# EAGLE schematic Node (EAGLE 9.5.2)
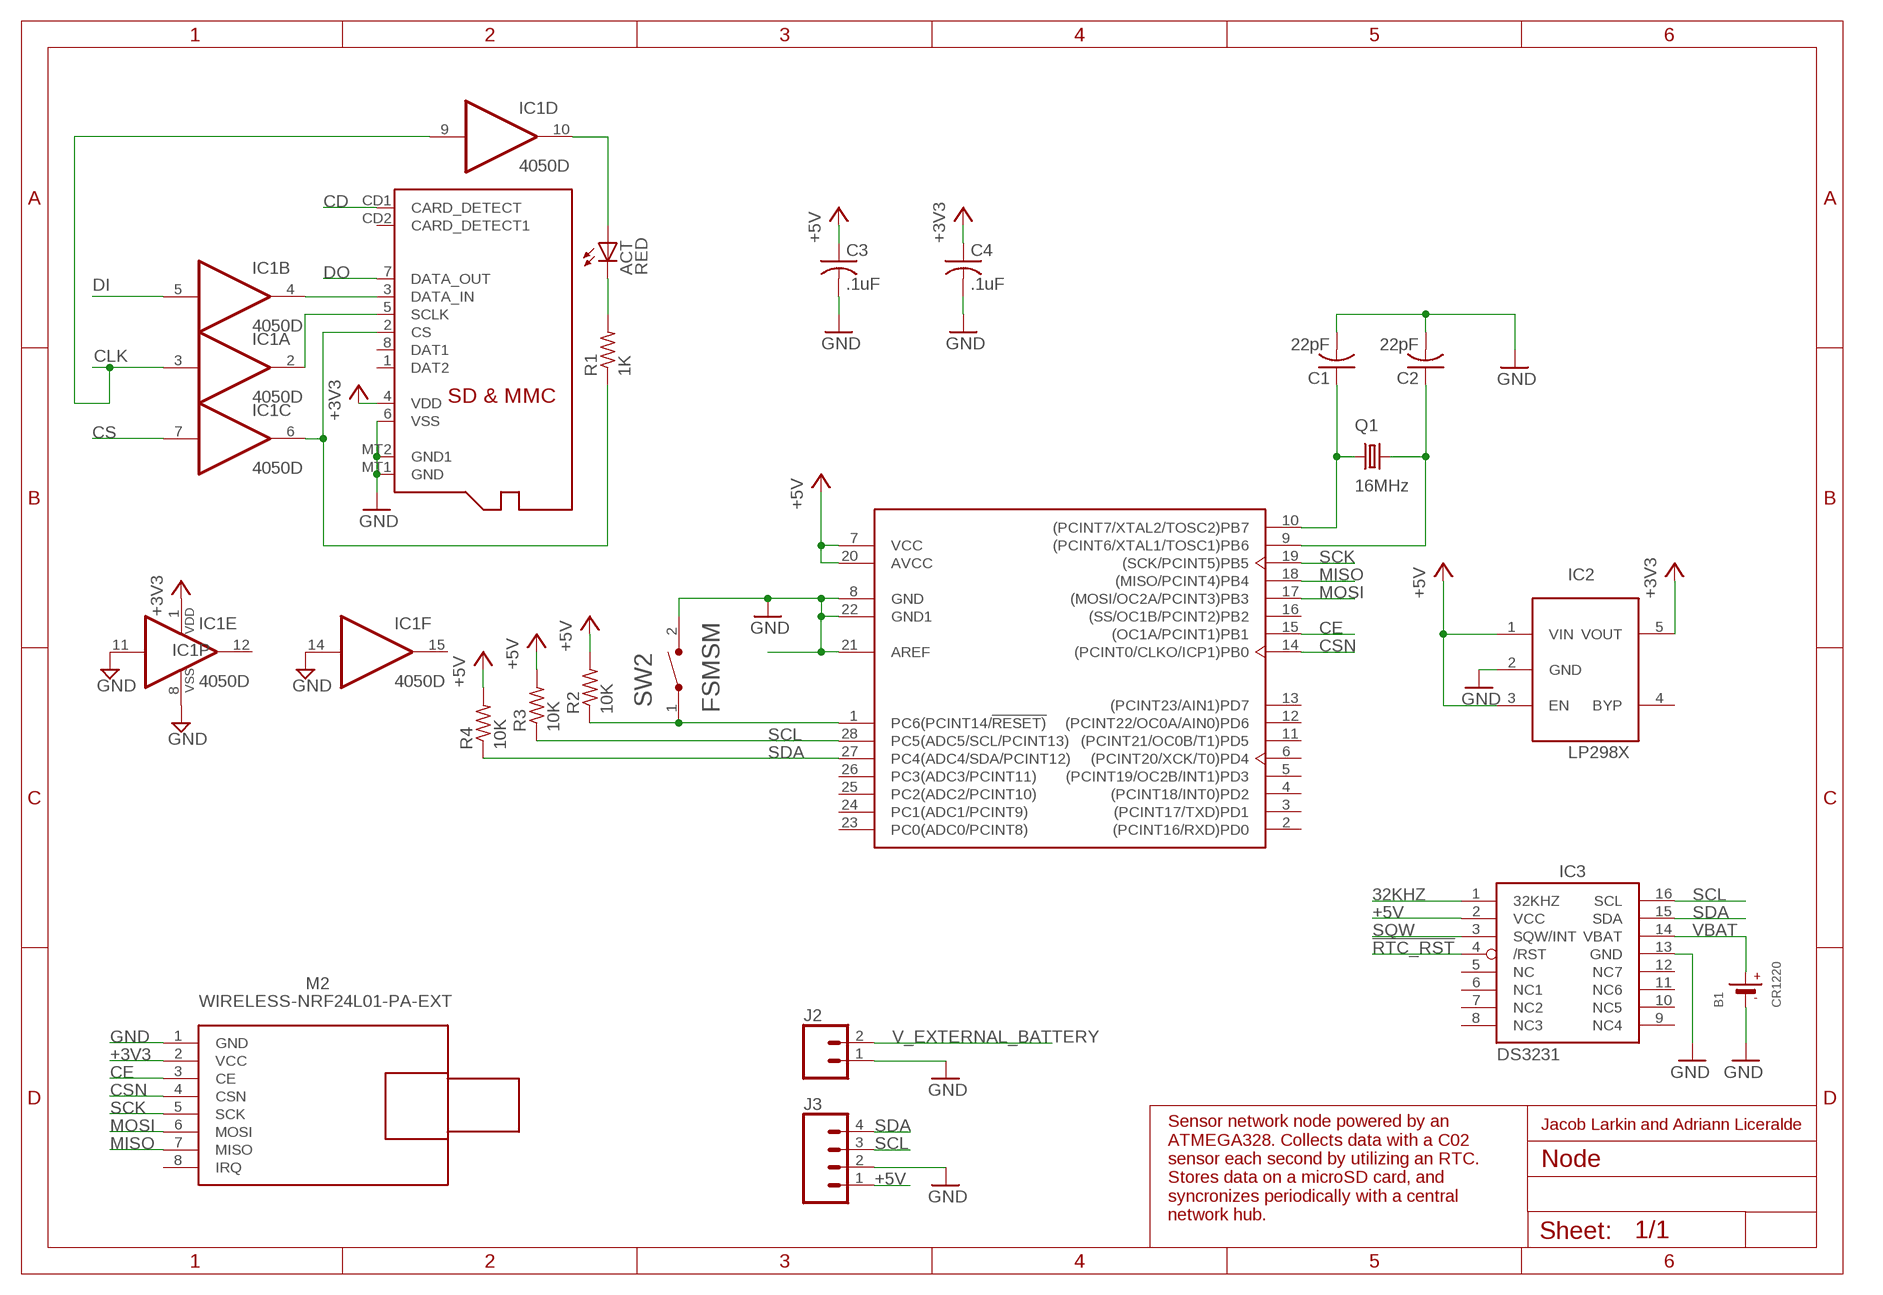
[diagram p0: schematic, sheet 1]

## Parts
ACT  RED  LEDCHIP-LED0805  [CHIP-LED0805]
B1  CR1220  BATTERYCR1220_SMT  [CR1220]
C1  22pF  C-US050-035X075  [C050-035X075]
C2  22pF  C-US050-035X075  [C050-035X075]
C3  .1uF  C-US050-035X075  [C050-035X075]
C4  .1uF  C-US050-035X075  [C050-035X075]
IC1  4050D  [SO16]
IC2  LP298XS  [SOT23-5L]
IC3  DS3231/SO  [SO16W]
J2  CONN_02JST-PTH-2  [JST-2-PTH]
J3  CONN_04JST-PTH  [JST-4-PTH]
M2  WIRELESS-NRF24L01-PA-EXT  [WIRELESS-NRF24L01-PA-EXT]
Q1  16MHz  CRYSTALHC49S  [HC49/S]
R1  1K  R-US_R0805  [R0805]
R2  10K  R-US_R0805  [R0805]
R3  10K  R-US_R0805  [R0805]
R4  10K  R-US_R0805  [R0805]
SW2  FSMSM  [FSMSM]
U2  ATMEGA328P-PU  [DIP-28]
X1  MICROSD  [MICROSD]

## Nets
32KHZ: IC3.1(32KHZ)
!RTC_RST: IC3.4(/RST)
+3V3: C4.1 IC1.1(P:VDD) IC2.5(VOUT) M2.2(VCC) X1.4(VDD)
+5V: C3.1 IC2.1(VIN) IC2.3(EN) IC3.2(VCC) J3.1 R2.2 R3.2 R4.2 U2.7(VCC) U2.20(AVCC)
CD: X1.CD1(CARD_DETECT)
CE: M2.3(CE) U2.15((OC1A/PCINT1)PB1)
CLK: IC1.3(A:I) IC1.9(D:I)
CS: IC1.7(C:I)
CSN: M2.4(CSN) U2.14((PCINT0/CLKO/ICP1)PB0)
DI: IC1.5(B:I)
DO: X1.7(DATA_OUT)
GND: B1.- C1.2 C2.2 C3.2 C4.2 IC2.2(GND) IC3.13(GND) J2.1 J3.2 M2.1(GND) SW2.2 U2.8(GND) U2.21(AREF) U2.22(GND1) X1.6(VSS) X1.MT1(GND) X1.MT2(GND1)
GND_SD: IC1.8(P:VSS) IC1.11(E:I) IC1.14(F:I) ; supply symbol labelled GND
MISO: M2.7(MISO) U2.18((MISO/PCINT4)PB4)
MOSI: M2.6(MOSI) U2.17((MOSI/OC2A/PCINT3)PB3)
N$1: ACT.A IC1.10(D:O)
N$2: IC1.2(A:O) X1.5(SCLK)
N$3: IC1.6(C:O) R1.1 X1.2(CS)
N$4: ACT.C R1.2
N$5: IC1.4(B:O) X1.3(DATA_IN)
N$6: R2.1 SW2.1 U2.1(PC6(PCINT14/!RESET))
N$7: C1.1 Q1.1 U2.10((PCINT7/XTAL2/TOSC2)PB7)
N$8: C2.1 Q1.2 U2.9((PCINT6/XTAL1/TOSC1)PB6)
SCK: M2.5(SCK) U2.19((SCK/PCINT5)PB5)
SCL: IC3.16(SCL) J3.3 R3.1 U2.28(PC5(ADC5/SCL/PCINT13))
SDA: IC3.15(SDA) J3.4 R4.1 U2.27(PC4(ADC4/SDA/PCINT12))
SQW: IC3.3(SQW/INT)
V_EXTERNAL_BATTERY: J2.2
VBAT: B1.+$1(+) IC3.14(VBAT)
Unconnected: IC1.12(E:O) IC1.15(F:O) IC2.4(BYP) IC3.5(NC) IC3.6(NC1) IC3.7(NC2) IC3.8(NC3) IC3.9(NC4) IC3.10(NC5) IC3.11(NC6) IC3.12(NC7) M2.8(IRQ) U2.2((PCINT16/RXD)PD0) U2.3((PCINT17/TXD)PD1) U2.4((PCINT18/INT0)PD2) U2.5((PCINT19/OC2B/INT1)PD3) U2.6((PCINT20/XCK/T0)PD4) U2.11((PCINT21/OC0B/T1)PD5) U2.12((PCINT22/OC0A/AIN0)PD6) U2.13((PCINT23/AIN1)PD7) U2.16((SS/OC1B/PCINT2)PB2) U2.23(PC0(ADC0/PCINT8)) U2.24(PC1(ADC1/PCINT9)) U2.25(PC2(ADC2/PCINT10)) U2.26(PC3(ADC3/PCINT11)) X1.1(DAT2) X1.8(DAT1) X1.CD2(CARD_DETECT1)

## Notes on the sheet
- Jacob Larkin and Adriann Liceralde
- Sensor network node powered by an
  ATMEGA328. Collects data with a C02
  sensor each second by utilizing an RTC.
  Stores data on a microSD card, and
  syncronizes periodically with a central
  network hub.

## Library data of the parts
ACT = adafruit:LED: LED OSRAM: - CHIPLED LG R971, LG N971, LY N971, LG Q971, LY Q971, LO R971, LY R971 LH N974, LH R974 LS Q976, LO Q976, LY Q976 LO Q996 - Hyper CHIPLED LW Q18S LB Q993, LB Q99A, LB R99A - SideLED LS A670, LO A670, LY A670, LG A670, LP A670 LB A673, LV A673, LT A673, LW A673 LH A674 LY A675 LS A676, LA A676, LO A676, LY A676, LW A676 LS A679, LY A679, LG A679 - Hyper Micro SIDELED® LS Y876, LA Y876, LO Y876, LY Y876 LT Y87S - SmartLED LW L88C, LW L88S LB L89C, LB L89S, LG L890 LS L89K, LO L89K, LY L89K LS L896, LA L896, LO L896, LY L896 - TOPLED LS T670, LO T670, LY T670, LG T670, LP T670 LSG T670, LSP T670, LSY T670, LOP T670, LYG T670 LG T671, LOG T671, LSG T671 LB T673, LV T673, LT T673, LW T673 LH T674 LS T676, LA T676, LO T676, LY T676, LB T676, LH T676, LSB T676, LW T676 LB T67C, LV T67C, LT T67C, LS T67K, LO T67K, LY T67K, LW E67C LS E67B, LA E67B, LO E67B, LY E67B, LB E67C, LV E67C, LT E67C LW T67C LS T679, LY T679, LG T679 LS T770, LO T770, LY T770, LG T770, LP T770 LB T773, LV T773, LT T773, LW T773 LH T774 LS E675, LA E675, LY E675, LS T675 LS T776, LA T776, LO T776, LY T776, LB T776 LHGB T686 LT T68C, LB T68C - Hyper Mini TOPLED® LB M676 - Mini TOPLED Santana® LG M470 LS M47K, LO M47K, LY M47K Source: http://www.osram.convergy.de/
B1 = microbuilder:BATTERY: CR1220 SMT - Digikey: 3001K-ND CD2032 BAT-HLD-001 - Digikey: BAT-HLD-001-ND
C1-C4 = rcl:C-US: CAPACITOR, American symbol; SPICEPREFIX: C
IC1 = 40xx:4050: Hex non-inverting BUFFER
IC2 = adafruit:LP298X
IC3 = adafruit:DS3231
J2 = SparkFun-Connectors:CONN_02: Multi connection point. Often used as Generic Header-pin footprint for 0.1 inch spaced/style header connections On any of the 0.1 inch spaced packages, you can populate with these: Break Away Headers - Straight <https://www.sparkfun.com/products/116> (PRT-00116) Break Away Male Headers - Right Angle <https://www.sparkfun.com/products/553> (PRT-00553) Female Headers <https://www.sparkfun.com/products/115> (PRT-00115) Break Away Headers - Machine Pin <https://www.sparkfun.com/products/117> (PRT-00117) Break Away Female Headers - Swiss Machine Pin <https://www.sparkfun.com/products/743> (PRT-00743) For SCREWTERMINALS and SPRING TERMINALS visit here: Screw Terimnals on SparkFun.com <https://www.sparkfun.com/search/results?term=Screw+Terminals> (5mm/3.5mm/2.54mm spacing) This device is also useful as a general connection point to wire up your design to another part of your project. Our various solder wires solder well into these plated through hole pads. Hook-Up Wire - Assortment (Stranded, 22 AWG) <https://www.sparkfun.com/products/11375> (PRT-11375) Hook-Up Wire - Assortment (Solid Core, 22 AWG) <https://www.sparkfun.com/products/11367> (PRT-11367) View the entire wire category on our website here <https://www.sparkfun.com/categories/141> Special notes: Molex polarized connector foot print use with: PRT-08233 with associated crimp pins and housings. 2.54_SCREWTERM for use with PRT-10571. 3.5mm Screw Terminal footprints for PRT-08084 5mm Screw Terminal footprints for use with PRT-08432; PROD_ID: CONN-09863; SKU: PRT-09914
J3 = SparkFun-Connectors:CONN_04: Multi connection point. Often used as Generic Header-pin footprint for 0.1 inch spaced/style header connections On any of the 0.1 inch spaced packages, you can populate with these: Break Away Headers - Straight <https://www.sparkfun.com/products/116> (PRT-00116) Break Away Male Headers - Right Angle <https://www.sparkfun.com/products/553> (PRT-00553) Female Headers <https://www.sparkfun.com/products/115> (PRT-00115) Break Away Headers - Machine Pin <https://www.sparkfun.com/products/117> (PRT-00117) Break Away Female Headers - Swiss Machine Pin <https://www.sparkfun.com/products/743> (PRT-00743) For SCREWTERMINALS and SPRING TERMINALS visit here: Screw Terimnals on SparkFun.com <https://www.sparkfun.com/search/results?term=Screw+Terminals> (5mm/3.5mm/2.54mm spacing) This device is also useful as a general connection point to wire up your design to another part of your project. Our various solder wires solder well into these plated through hole pads. Hook-Up Wire - Assortment (Stranded, 22 AWG) <https://www.sparkfun.com/products/11375> (PRT-11375) Hook-Up Wire - Assortment (Solid Core, 22 AWG) <https://www.sparkfun.com/products/11367> (PRT-11367) View the entire wire category on our website here <https://www.sparkfun.com/categories/141> Special notes: Molex polarized connector foot print use with SKU : PRT-08231 with associated crimp pins and housings. 1MM SMD Version SKU: PRT-10208; PROD_ID: WIRE-13531; SF_ID: PRT-09916
M2 = diy-modules:WIRELESS-NRF24L01-PA-EXT: 2.4 GHz Wireless Module based on NRF24L01 chip with preamplifier and external antenna Click here to find device on ebay.com <http://www.ebay.com/sch/nrf24l01+pa+lna+sma>
Q1 = crystal:CRYSTAL: CRYSTAL; OC_FARNELL: 1667008; OC_NEWARK: unknown
R1 = adafruit:R-US_: RESISTOR, American symbol
R2-R4 = rcl:R-US_: RESISTOR, American symbol; SPICEPREFIX: R
SW2 = Switch:FSMSM: SWITCH TACTILE SPST-NO 0.05A 24V Manufacturer's datasheet <https://www.te.com/commerce/DocumentDelivery/DDEController?Action=srchrtrv&DocNm=1437566-3&DocType=Customer+Drawing&DocLang=English>; CREATED_BY: PCBLayout.com; DIGIKEY_PART_NUMBER: 450-1140-ND; MANUFACTURER: TE Connectivity ALCOSWITCH Switches; MPN: FSMSM
U2 = Microcontroller:ATMEGA328P-PU: IC MCU 8BIT 32KB FLASH 28DIP Manufacturer's datasheet <http://ww1.microchip.com/downloads/en/DeviceDoc/ATmega48A-PA-88A-PA-168A-PA-328-P-DS-DS40002061A.pdf>; CREATED_BY: PCBLayout.com; DIGIKEY_PART_NUMBER: ATMEGA328P-PU-ND; MANUFACTURER: Microchip Technology; MPN: ATMEGA328P-PU; PACKAGE: DIP-28
X1 = adafruit:MICROSD: Micro-SD / Transflash card holder with SPI pinout For the 3M # 2908-05WB-MG and/or 4UCON #19656 push-push type